# Altium schematic sheet Counter.SchDoc
size A; Organization: Altium Limited; Address1: L3, 12a Rodborough Rd; Address2: Frenchs Forest; Address3: NSW; Address4: Australia 2086; DocumentNumber: 2; SheetNumber: 2; SheetTotal: 2
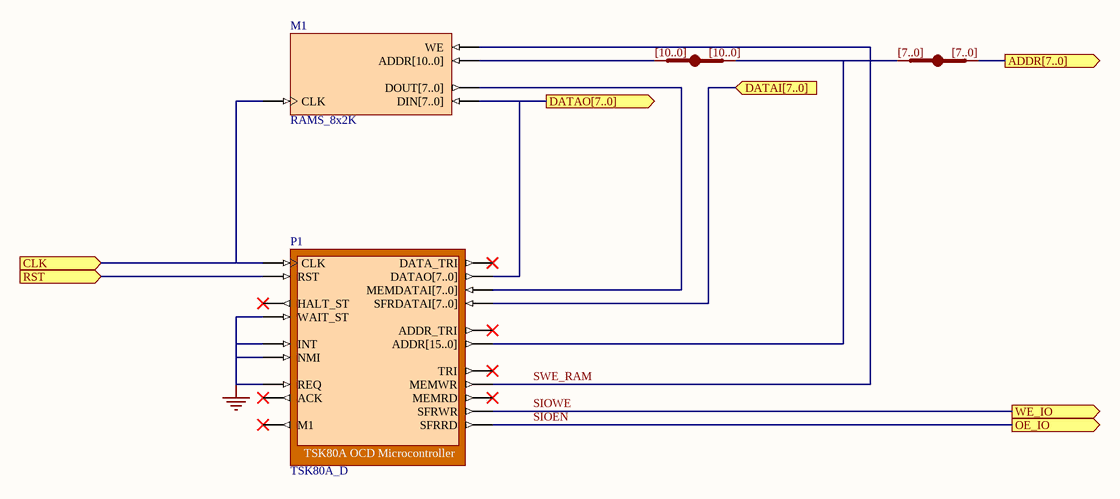
[diagram p0: Counter.SchDoc]

## Parts
M1  RAMS_8x2K
P1  TSK80A_D
U1  IndexA: [10..0]  (hidden comment: JB)
U8  IndexA: [7..0]  (hidden comment: JB)

## Ports
ADDR[7..0] (out), CLK (in), DATAI[7..0] (in), DATAO[7..0] (out), OE_IO (out), RST (in), WE_IO (out)

## Nets
GND: P1.INT P1.NMI P1.REQ P1.WAIT_ST
ADDR[7..0]: U8.B[0..0] ; port ADDR[7..0]
CLK: M1.CLK P1.CLK ; port CLK
DATAI[7..0]: P1.SFRDATAI[7..0] ; port DATAI[7..0]
DATAO[7..0]: M1.DIN[7..0] P1.DATAO[7..0] ; port DATAO[7..0]
RST: P1.RST ; port RST
SIOEN: P1.SFRRD ; port OE_IO
SIOWE: P1.SFRWR ; port WE_IO
SWE_RAM: M1.WE P1.MEMWR
NetM1_ADDR[10..0]: M1.ADDR[10..0] U1.B[0..0]
NetM1_DOUT[7..0]: M1.DOUT[7..0] P1.MEMDATAI[7..0]
NetP1_ADDR[15..0]: P1.ADDR[15..0] U1.A[0..0] U8.A[0..0]

Not connected (* = marked no-connect by the designer): P1 ACK* ADDR_TRI* DATA_TRI* HALT_ST* M1* MEMRD* TRI*

## Notes on the sheet
- Title
- Size:
- Date:
- A
- Number:
- Time:
- Revision:
- Sheet
- of
- File:

## Library data of the parts
M1 = RAMS_8x2K: Single Port Random Access Memory; Memory_Depth: 2048; Memory_Type: RAM_SinglePortBlock; Memory_Width: 8; Memory_ClockEdge: Rising; Nexus_Core: Memory_Program; Published: 13/01/2004; Publisher: Altium Hobart Technology Center
P1 = TSK80A_D: TSK80A OCD Microcontroller; ChildCore1: M1; NEXUS_CORE: Processor_OCDS; NEXUS_JTAG_DEVICE: True; NEXUS_JTAG_ORDER: 0; Memory_Configuration: Record[NEXUS_CORE]{}ComponentDesignator[xrom]{}Memory_Depth[1k]{}Memory_UsageType[rom]{}ProgramDownloadAddress[0x0]{}Memory_BusType[cz80:mem_bus]{n}Record[NEXUS_CORE]{}ComponentDesignator[xram]{}Memory_Depth[1k]{}Memory_UsageType[ram]{}ProgramDownloadAddress[1k]{}Memory_BusType[cz80:mem_bus]{n}Record[NEXUS_CORE]{}ComponentDesignator[sfr]{}Memory_Depth[64k]{}Memory_UsageType[ram]{}ProgramDownloadAddress[0x0]{}Memory_BusType[cz80:sfr_bus]{n}; Published: 7/01/2004; Publisher: Altium Hobart Technology Centre; Core Revision: 1.00.00
U1 U8 = JB: System BUS Joiner; ArchiveName: GENERIC; Published: 18-Dec-2003; Publisher: Altium Limited; Core Revision: 1.00.00
  U1: IndexB: [10..0]
  U8: IndexB: [7..0]